# Altium schematic sheet ACCU.SchDoc
size A2
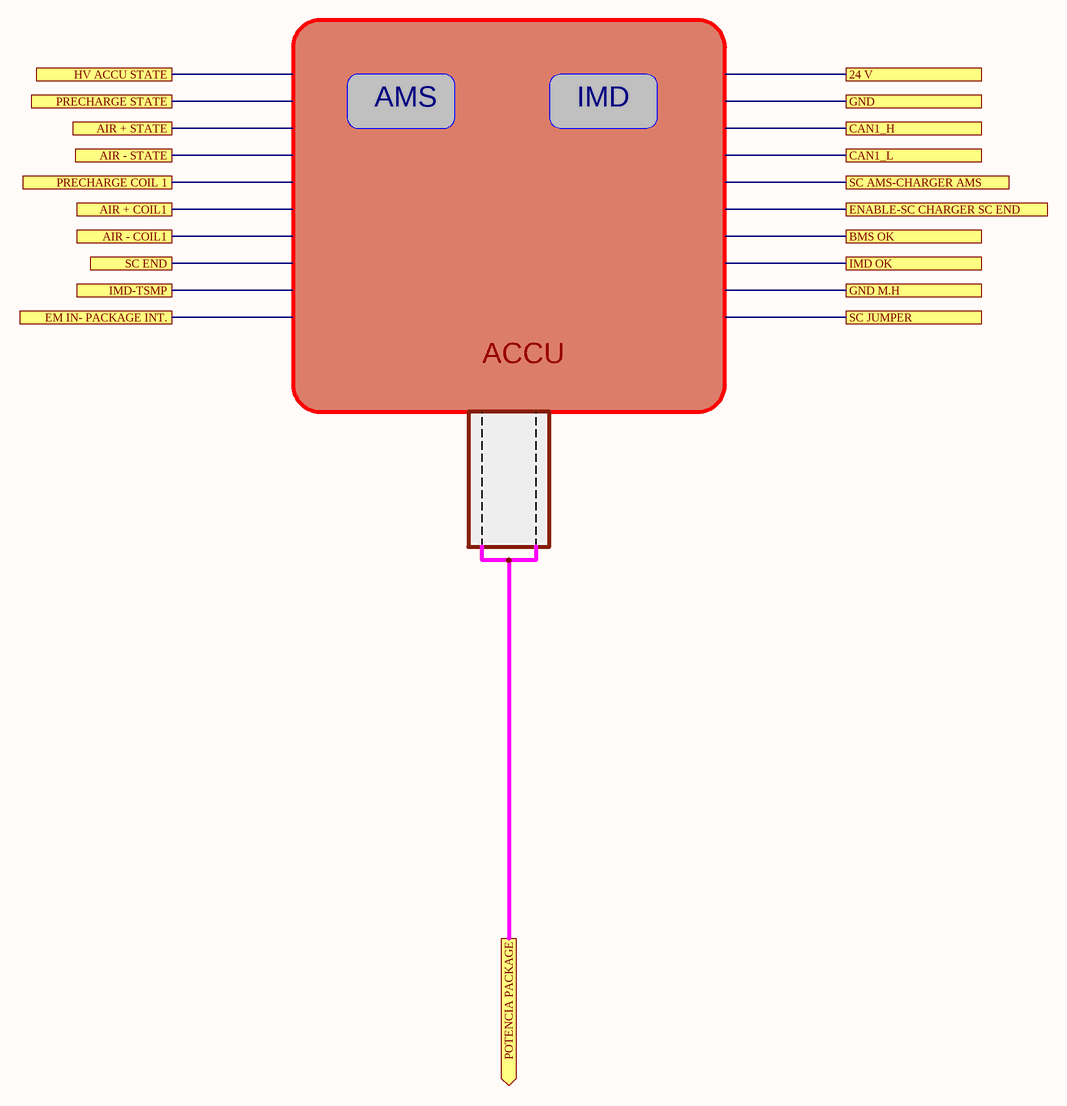
[diagram p0: ACCU.SchDoc]

## Ports
24 V, AIR + COIL1, AIR + STATE, AIR - COIL1, AIR - STATE, BMS OK, CAN1_H, CAN1_L, EM IN- PACKAGE INT., ENABLE-SC CHARGER SC END, GND, GND M.H, HV ACCU STATE, IMD OK, IMD-TSMP, POTENCIA PACKAGE (out), PRECHARGE COIL 1, PRECHARGE STATE, SC AMS-CHARGER AMS, SC END, SC JUMPER

## Notes on the sheet
- AMS
- IMD
- ACCU